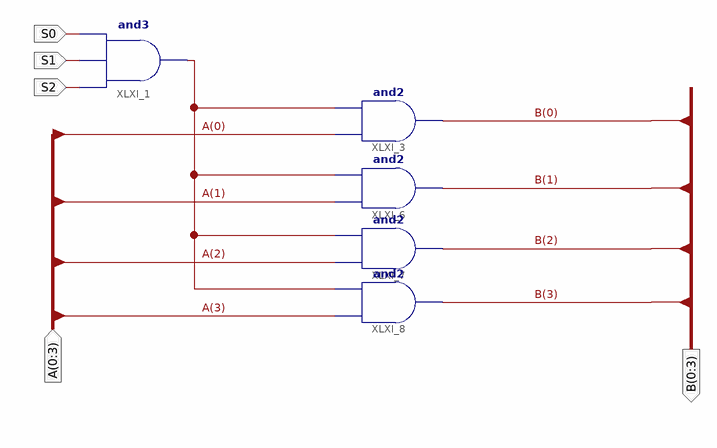
[diagram p0: schematic sheet 1]
// Xilinx ISE schematic BUS4SELECT.sch (spartan3e) as structural Verilog: 5 symbols, 5 ports
module BUS4SELECT (
  input  S0,
  input  S1,
  input  S2,
  input  [0:3] A,
  output [0:3] B
);

  wire XLXN_7;

  and XLXI_1 (XLXN_7, S2, S1, S0);
  and XLXI_3 (B[0], A[0], XLXN_7);
  and XLXI_6 (B[1], A[1], XLXN_7);
  and XLXI_7 (B[2], A[2], XLXN_7);
  and XLXI_8 (B[3], A[3], XLXN_7);
endmodule
